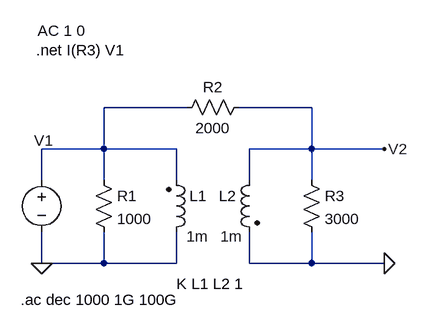
[diagram p0: schematic Circuito1b.asc]
Circuito1b.asc, the LTspice schematic file:
Version 4
SHEET 1 880 680
WIRE 256 32 128 32
WIRE 448 32 336 32
WIRE 128 96 128 32
WIRE 128 96 32 96
WIRE 240 96 128 96
WIRE 448 96 448 32
WIRE 448 96 352 96
WIRE 560 96 448 96
WIRE 32 144 32 96
WIRE 128 144 128 96
WIRE 240 144 240 96
WIRE 352 144 352 96
WIRE 448 144 448 96
WIRE 32 272 32 224
WIRE 128 272 128 224
WIRE 128 272 32 272
WIRE 240 272 240 224
WIRE 240 272 128 272
WIRE 352 272 352 224
WIRE 448 272 448 224
WIRE 448 272 352 272
WIRE 560 272 448 272
FLAG 560 96 V2
FLAG 32 272 0
FLAG 560 272 0
SYMBOL res 112 128 R0
SYMATTR InstName R1
SYMATTR Value 1000
SYMBOL ind2 224 240 M180
WINDOW 0 36 72 Left 2
WINDOW 3 31 9 Left 2
SYMATTR InstName L1
SYMATTR Value 1m
SYMATTR Type ind
SYMBOL ind2 368 128 M0
WINDOW 3 27 103 Left 2
SYMATTR Value 1m
SYMATTR InstName L2
SYMATTR Type ind
SYMBOL res 432 128 R0
SYMATTR InstName R3
SYMATTR Value 3000
SYMBOL res 352 16 R90
WINDOW 0 0 56 VBottom 2
WINDOW 3 32 56 VTop 2
SYMATTR InstName R2
SYMATTR Value 2000
SYMBOL voltage 32 128 R0
WINDOW 0 -11 -45 Left 2
WINDOW 3 -23 -282 Left 2
WINDOW 123 -6 -214 Left 2
WINDOW 39 0 0 Left 0
SYMATTR InstName V1
SYMATTR Value ""
SYMATTR Value2 AC 1 0
TEXT 240 304 Left 2 !K L1 L2 1
TEXT 24 -56 Left 2 !.net I(R3) V1
TEXT 0 328 Left 2 !.ac dec 1000 1G 100G

The netlist it stands for:
* Circuito1b.asc
R1 N001 0 1000
L1 0 N001 1m
L2 V2 0 1m
R3 V2 0 3000
R2 V2 N001 2000
V1 N001 0 AC 1 0
K L1 L2 1
.net I(R3) V1
.ac dec 1000 1G 100G
.backanno
.end